# EAGLE schematic raf1-rev3 (EAGLE 7.1.0)
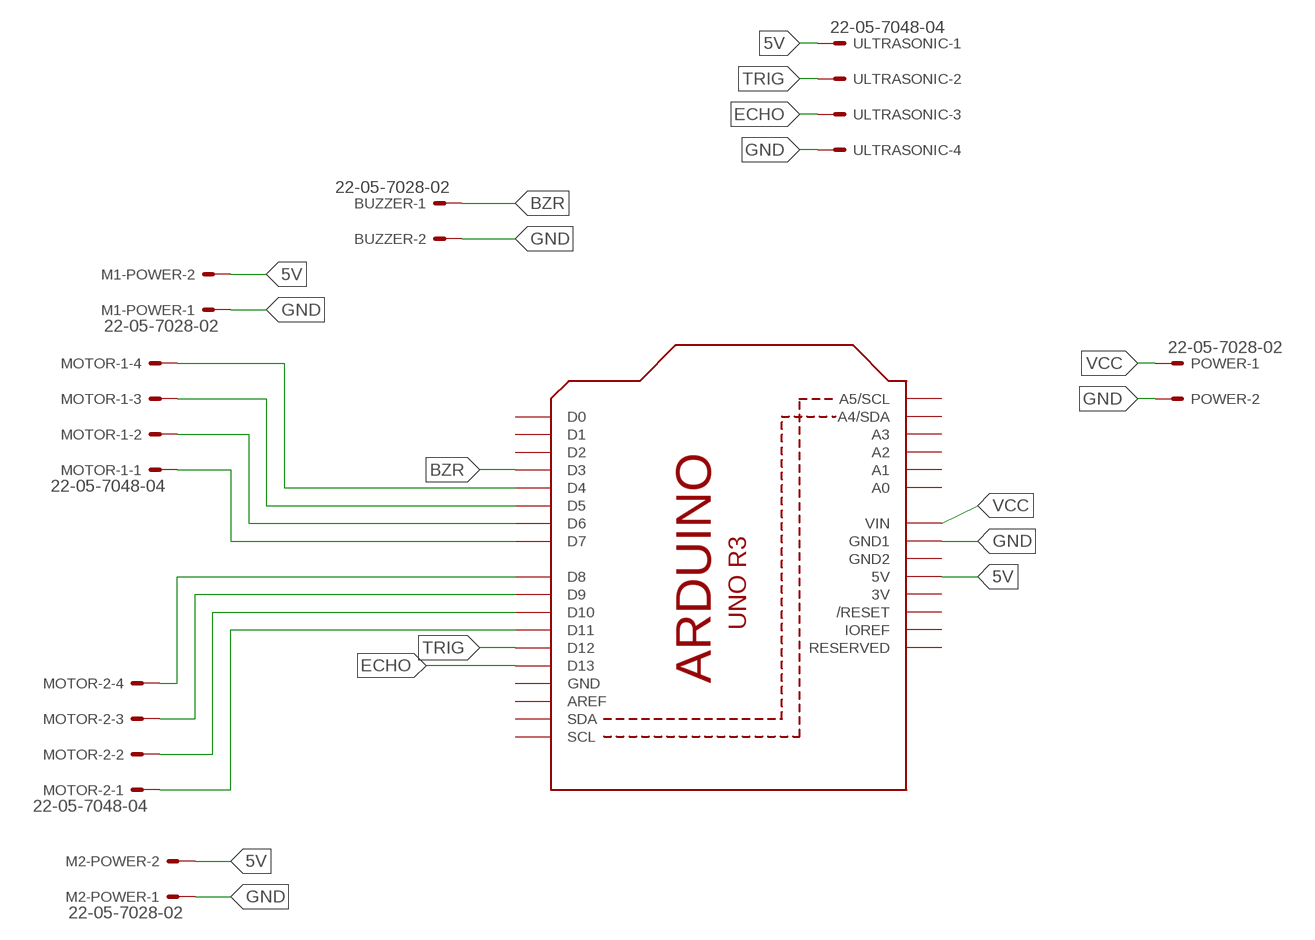
[diagram p0: schematic, sheet 1]

## Parts
BUZZER  22-05-7028-02  [7395-02]
M1-POWER  22-05-7028-02  [7395-02]
M2-POWER  22-05-7028-02  [7395-02]
MOTOR-1  22-05-7048-04  [7395-04]
MOTOR-2  22-05-7048-04  [7395-04]
POWER  22-05-7028-02  [7395-02]
U1  ARDUINOR3-BPLACE  [ARDUINOR3-BPLACE]
ULTRASONIC  22-05-7048-04  [7395-04]

## Nets
5V: M1-POWER.2 M2-POWER.2 U1.5V ULTRASONIC.1
BZR: BUZZER.1 U1.D3
ECHO: U1.D13 ULTRASONIC.3
GND: BUZZER.2 M1-POWER.1 M2-POWER.1 POWER.2 U1.GND1 ULTRASONIC.4
MOTOR1-1: MOTOR-1.1 U1.D7
MOTOR1-2: MOTOR-1.2 U1.D6
MOTOR1-3: MOTOR-1.3 U1.D5
MOTOR1-4: MOTOR-1.4 U1.D4
MOTOR2-1: MOTOR-2.1 U1.D11
MOTOR2-2: MOTOR-2.2 U1.D10
MOTOR2-3: MOTOR-2.3 U1.D9
MOTOR2-4: MOTOR-2.4 U1.D8
TRIG: U1.D12 ULTRASONIC.2
VCC: POWER.1 U1.VIN
Unconnected: U1.A0 U1.A1 U1.A2 U1.A3 U1.A4(A4/SDA) U1.A5(A5/SCL) U1.AREF U1.D0 U1.D1 U1.D2 U1.IOREF U1.RESERVED U1.RESET(/RESET) U1.SCL U1.SDA

## Power pins joined to a net without a drawn wire
3V: U1.3V
GND: U1.GND
GND2: U1.GND2

## Library data of the parts
BUZZER M1-POWER M2-POWER POWER = con-molex:22-?-02: CONNECTOR wire to board 2.54 mm (.1 inch) pitch header
MOTOR-1 MOTOR-2 ULTRASONIC = con-molex:22-?-04: CONNECTOR wire to board 2.54 mm (.1 inch) pitch header
U1 = adafruit:ARDUINOR3: This is a new object for the new Arduino R3 - with extra pins that you may want to use (such as IOref, and duplicated A4/A5

## Net classes
0 default: width 0.762 mm, drill 0.508 mm, clearance 0.762 mm